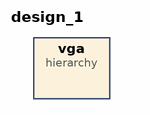
[diagram p0: block diagram of the top level]
# Vivado block design design_1, xc7a100tcsg324-1, Vivado 2019.2
create_bd_design design_1

create_bd_cell -type hier vga

# ---- hierarchy /vga ----
current_bd_instance /vga
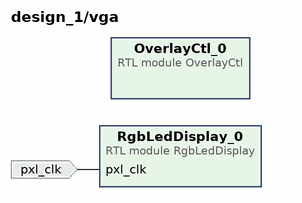
[diagram p1: block diagram inside /vga]
create_bd_pin -dir I -type clk pxl_clk

create_bd_cell -type module -reference RgbLedDisplay RgbLedDisplay_0
create_bd_cell -type module -reference OverlayCtl OverlayCtl_0

# ---- connections ----

current_bd_instance /vga
connect_bd_net [get_bd_pins pxl_clk] [get_bd_pins RgbLedDisplay_0/pxl_clk]

validate_bd_design
save_bd_design
